# Altium project STEERING_WHEEL_SWITCHES_V2_CONTROLLER.PrjPcb (part 2 of 2)
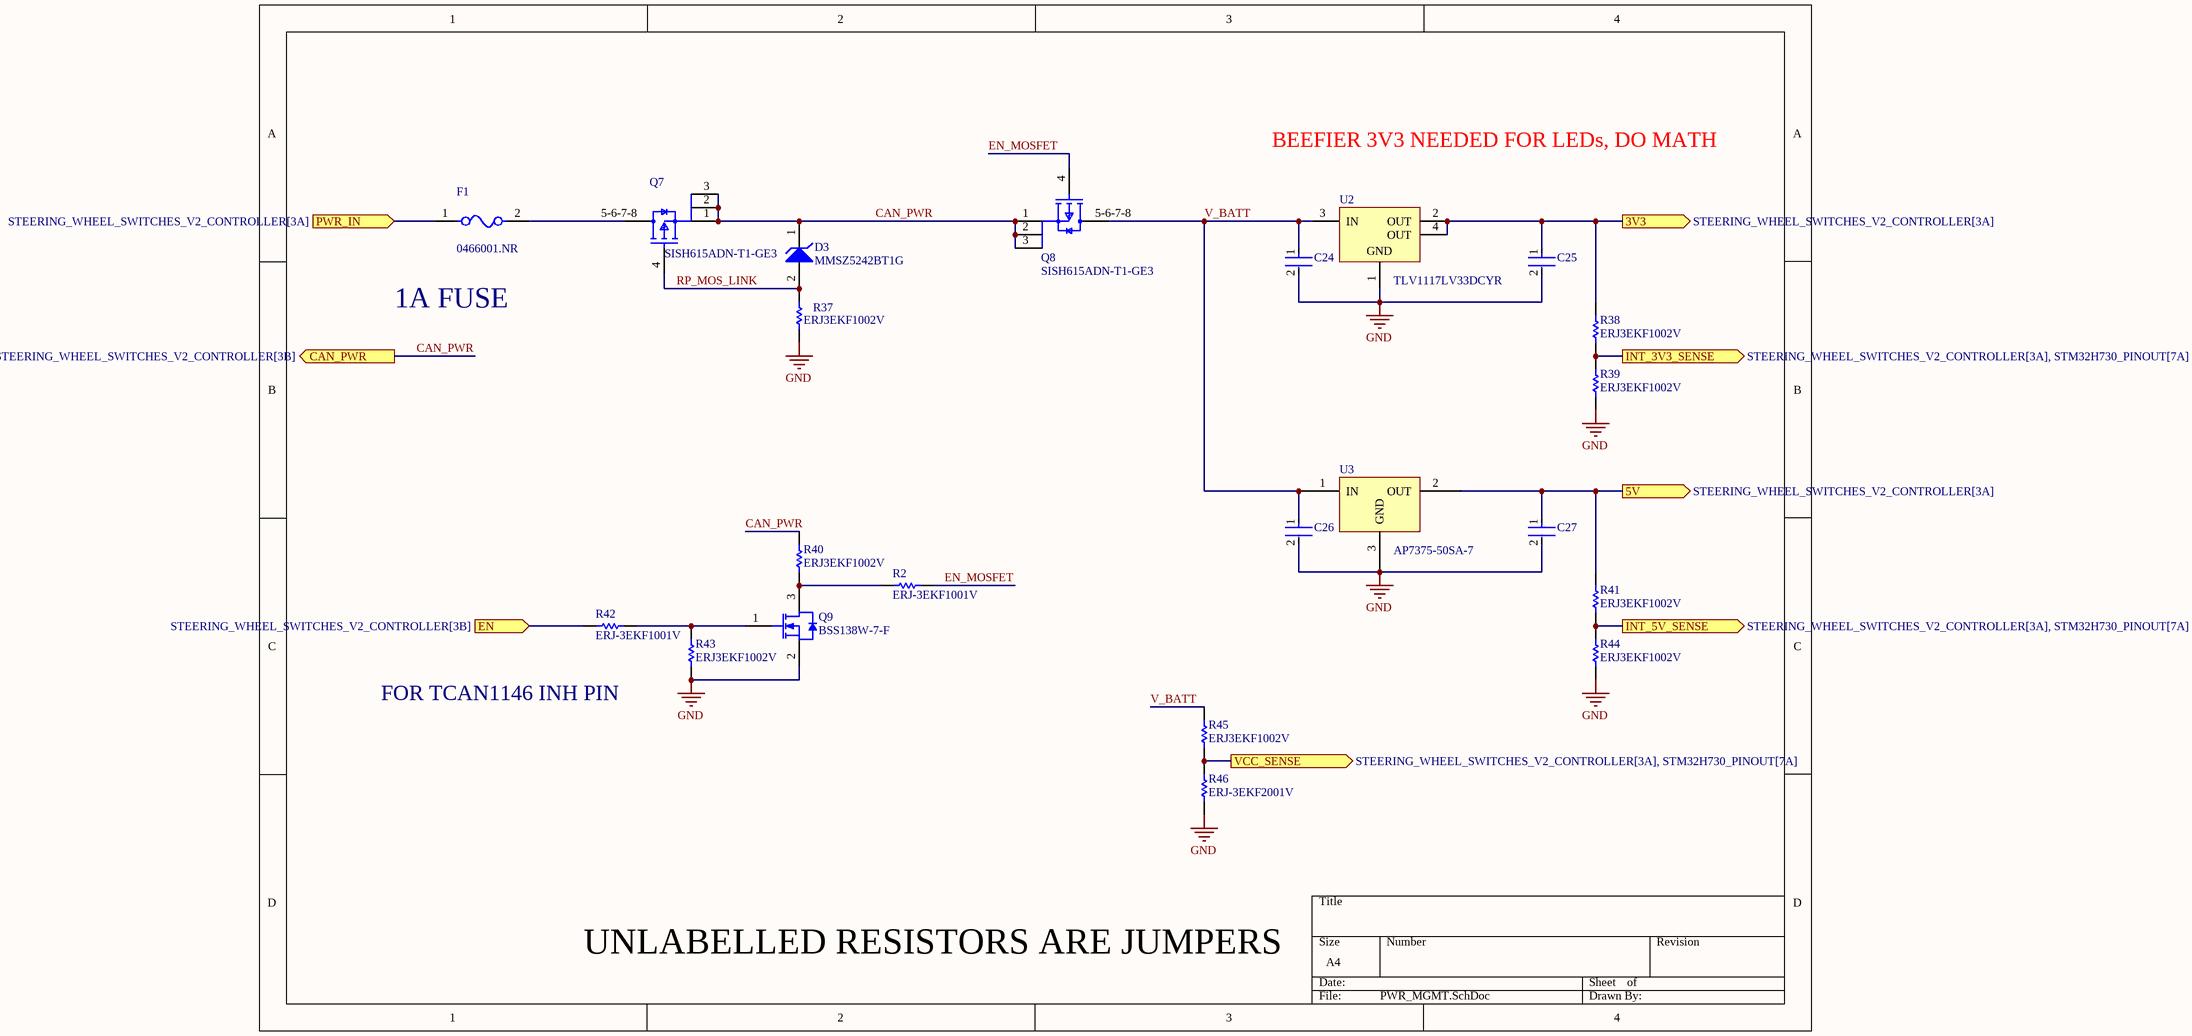
[diagram p9: PWR_MGMT.SchDoc]

## Nets that join several sheets
3V3: STM32H730_PINOUT (27 pins), LED_ARRAY_0 (16 pins), LED_ARRAY_1 (16 pins), PWR_MGMT (C25.1 R38.2 U2.2 U2.4)
GND: STEERING_WHEEL_SWITCHES_V2_CONTROLLER (7 pins), STM32H730_PINOUT (38 pins), LED_ARRAY_0 (R1_LED_ARRAY_0.2), LED_ARRAY_1 (R1_LED_ARRAY_1.2), PWR_MGMT (12 pins)
BLU_ENABLE: STM32H730_PINOUT (U1.39), LED_ARRAY_1 (R31_LED_ARRAY_1.1)
BLU_ENABLE: STM32H730_PINOUT (U1.64), LED_ARRAY_0 (R31_LED_ARRAY_0.1)
GRN_ENABLE: STM32H730_PINOUT (U1.44), LED_ARRAY_1 (R25_LED_ARRAY_1.1)
GRN_ENABLE: STM32H730_PINOUT (U1.68), LED_ARRAY_0 (R25_LED_ARRAY_0.1)
INT_3V3_SENSE: STM32H730_PINOUT (U1.22), PWR_MGMT (R38.1 R39.2)
INT_5V_SENSE: STM32H730_PINOUT (U1.24), PWR_MGMT (R41.1 R44.1)
LED_GND_BLU_0: STEERING_WHEEL_SWITCHES_V2_CONTROLLER (J2.17), LED_ARRAY_0 (Q6_LED_ARRAY_0.6)
LED_GND_BLU_1: STEERING_WHEEL_SWITCHES_V2_CONTROLLER (J3.17), LED_ARRAY_1 (Q6_LED_ARRAY_1.6)
LED_GND_GRN_0: STEERING_WHEEL_SWITCHES_V2_CONTROLLER (J2.19), LED_ARRAY_0 (Q1_LED_ARRAY_0.3)
LED_GND_GRN_1: STEERING_WHEEL_SWITCHES_V2_CONTROLLER (J3.19), LED_ARRAY_1 (Q1_LED_ARRAY_1.3)
LED_GND_RED_0: STEERING_WHEEL_SWITCHES_V2_CONTROLLER (J2.20), LED_ARRAY_0 (Q1_LED_ARRAY_0.6)
LED_GND_RED_1: STEERING_WHEEL_SWITCHES_V2_CONTROLLER (J3.20), LED_ARRAY_1 (Q1_LED_ARRAY_1.6)
LED_POS_0: STEERING_WHEEL_SWITCHES_V2_CONTROLLER (J2.1), LED_ARRAY_0 (Q2_LED_ARRAY_0.3)
LED_POS_0: STEERING_WHEEL_SWITCHES_V2_CONTROLLER (J3.1), LED_ARRAY_1 (Q2_LED_ARRAY_1.3)
LED_POS_1: STEERING_WHEEL_SWITCHES_V2_CONTROLLER (J2.3), LED_ARRAY_0 (Q2_LED_ARRAY_0.6)
LED_POS_1: STEERING_WHEEL_SWITCHES_V2_CONTROLLER (J3.3), LED_ARRAY_1 (Q2_LED_ARRAY_1.6)
LED_POS_2: STEERING_WHEEL_SWITCHES_V2_CONTROLLER (J2.5), LED_ARRAY_0 (Q4_LED_ARRAY_0.3)
LED_POS_3: STEERING_WHEEL_SWITCHES_V2_CONTROLLER (J2.7), LED_ARRAY_0 (Q4_LED_ARRAY_0.6)
LED_POS_4: STEERING_WHEEL_SWITCHES_V2_CONTROLLER (J2.9), LED_ARRAY_0 (Q3_LED_ARRAY_0.3)
LED_POS_5: STEERING_WHEEL_SWITCHES_V2_CONTROLLER (J2.11), LED_ARRAY_0 (Q3_LED_ARRAY_0.6)
LED_POS_6: STEERING_WHEEL_SWITCHES_V2_CONTROLLER (J2.13), LED_ARRAY_0 (Q5_LED_ARRAY_0.3)
LED_POS_7: STEERING_WHEEL_SWITCHES_V2_CONTROLLER (J2.15), LED_ARRAY_0 (Q5_LED_ARRAY_0.6)
LED_POS_10: STEERING_WHEEL_SWITCHES_V2_CONTROLLER (J3.5), LED_ARRAY_1 (Q4_LED_ARRAY_1.3)
LED_POS_11: STEERING_WHEEL_SWITCHES_V2_CONTROLLER (J3.7), LED_ARRAY_1 (Q4_LED_ARRAY_1.6)
LED_POS_12: STEERING_WHEEL_SWITCHES_V2_CONTROLLER (J3.9), LED_ARRAY_1 (Q3_LED_ARRAY_1.3)
LED_POS_13: STEERING_WHEEL_SWITCHES_V2_CONTROLLER (J3.11), LED_ARRAY_1 (Q3_LED_ARRAY_1.6)
LED_POS_14: STEERING_WHEEL_SWITCHES_V2_CONTROLLER (J3.13), LED_ARRAY_1 (Q5_LED_ARRAY_1.3)
LED_POS_15: STEERING_WHEEL_SWITCHES_V2_CONTROLLER (J3.15), LED_ARRAY_1 (Q5_LED_ARRAY_1.6)
nLED_TRIG_0: STM32H730_PINOUT (U1.35), LED_ARRAY_1 (R23_LED_ARRAY_1.2)
nLED_TRIG_0: STM32H730_PINOUT (U1.61), LED_ARRAY_0 (R23_LED_ARRAY_0.2)
nLED_TRIG_1: STM32H730_PINOUT (U1.36), LED_ARRAY_1 (R19_LED_ARRAY_1.2)
nLED_TRIG_1: STM32H730_PINOUT (U1.62), LED_ARRAY_0 (R19_LED_ARRAY_0.2)
nLED_TRIG_2: STM32H730_PINOUT (U1.63), LED_ARRAY_0 (R35_LED_ARRAY_0.2)
nLED_TRIG_3: STM32H730_PINOUT (U1.66), LED_ARRAY_0 (R29_LED_ARRAY_0.2)
nLED_TRIG_4: STM32H730_PINOUT (U1.67), LED_ARRAY_0 (R24_LED_ARRAY_0.2)
nLED_TRIG_5: STM32H730_PINOUT (U1.69), LED_ARRAY_0 (R20_LED_ARRAY_0.2)
nLED_TRIG_6: STM32H730_PINOUT (U1.70), LED_ARRAY_0 (R36_LED_ARRAY_0.2)
nLED_TRIG_7: STM32H730_PINOUT (U1.71), LED_ARRAY_0 (R30_LED_ARRAY_0.2)
nLED_TRIG_10: STM32H730_PINOUT (U1.38), LED_ARRAY_1 (R35_LED_ARRAY_1.2)
nLED_TRIG_11: STM32H730_PINOUT (U1.42), LED_ARRAY_1 (R29_LED_ARRAY_1.2)
nLED_TRIG_12: STM32H730_PINOUT (U1.43), LED_ARRAY_1 (R24_LED_ARRAY_1.2)
nLED_TRIG_13: STM32H730_PINOUT (U1.46), LED_ARRAY_1 (R20_LED_ARRAY_1.2)
nLED_TRIG_14: STM32H730_PINOUT (U1.45), LED_ARRAY_1 (R36_LED_ARRAY_1.2)
nLED_TRIG_15: STM32H730_PINOUT (U1.47), LED_ARRAY_1 (R30_LED_ARRAY_1.2)
PWR_IN: STEERING_WHEEL_SWITCHES_V2_CONTROLLER (J1.1), PWR_MGMT (F1.1)
RED_ENABLE: STM32H730_PINOUT (U1.41), LED_ARRAY_1 (R15_LED_ARRAY_1.1)
RED_ENABLE: STM32H730_PINOUT (U1.65), LED_ARRAY_0 (R15_LED_ARRAY_0.1)
SW_IN_0: STEERING_WHEEL_SWITCHES_V2_CONTROLLER (J2.2), STM32H730_PINOUT (U1.88)
SW_IN_1: STEERING_WHEEL_SWITCHES_V2_CONTROLLER (J2.4), STM32H730_PINOUT (U1.87)
SW_IN_2: STEERING_WHEEL_SWITCHES_V2_CONTROLLER (J2.6), STM32H730_PINOUT (U1.86)
SW_IN_3: STEERING_WHEEL_SWITCHES_V2_CONTROLLER (J2.8), STM32H730_PINOUT (U1.85)
SW_IN_4: STEERING_WHEEL_SWITCHES_V2_CONTROLLER (J2.10), STM32H730_PINOUT (U1.84)
SW_IN_5: STEERING_WHEEL_SWITCHES_V2_CONTROLLER (J2.12), STM32H730_PINOUT (U1.81)
SW_IN_6: STEERING_WHEEL_SWITCHES_V2_CONTROLLER (J2.14), STM32H730_PINOUT (U1.83)
SW_IN_7: STEERING_WHEEL_SWITCHES_V2_CONTROLLER (J2.16), STM32H730_PINOUT (U1.82)
SW_IN_8: STEERING_WHEEL_SWITCHES_V2_CONTROLLER (J3.2), STM32H730_PINOUT (U1.29)
SW_IN_9: STEERING_WHEEL_SWITCHES_V2_CONTROLLER (J3.4), STM32H730_PINOUT (U1.30)
SW_IN_10: STEERING_WHEEL_SWITCHES_V2_CONTROLLER (J3.6), STM32H730_PINOUT (U1.31)
SW_IN_11: STEERING_WHEEL_SWITCHES_V2_CONTROLLER (J3.8), STM32H730_PINOUT (U1.32)
SW_IN_12: STEERING_WHEEL_SWITCHES_V2_CONTROLLER (J3.10), STM32H730_PINOUT (U1.33)
SW_IN_13: STEERING_WHEEL_SWITCHES_V2_CONTROLLER (J3.12), STM32H730_PINOUT (U1.34)
SW_IN_14: STEERING_WHEEL_SWITCHES_V2_CONTROLLER (J3.14), STM32H730_PINOUT (U1.37)
SW_IN_15: STEERING_WHEEL_SWITCHES_V2_CONTROLLER (J3.16), STM32H730_PINOUT (U1.40)
VCC_SENSE: STM32H730_PINOUT (U1.23), PWR_MGMT (R45.1 R46.2)